# EAGLE design W061C (EAGLE 6.6.0)
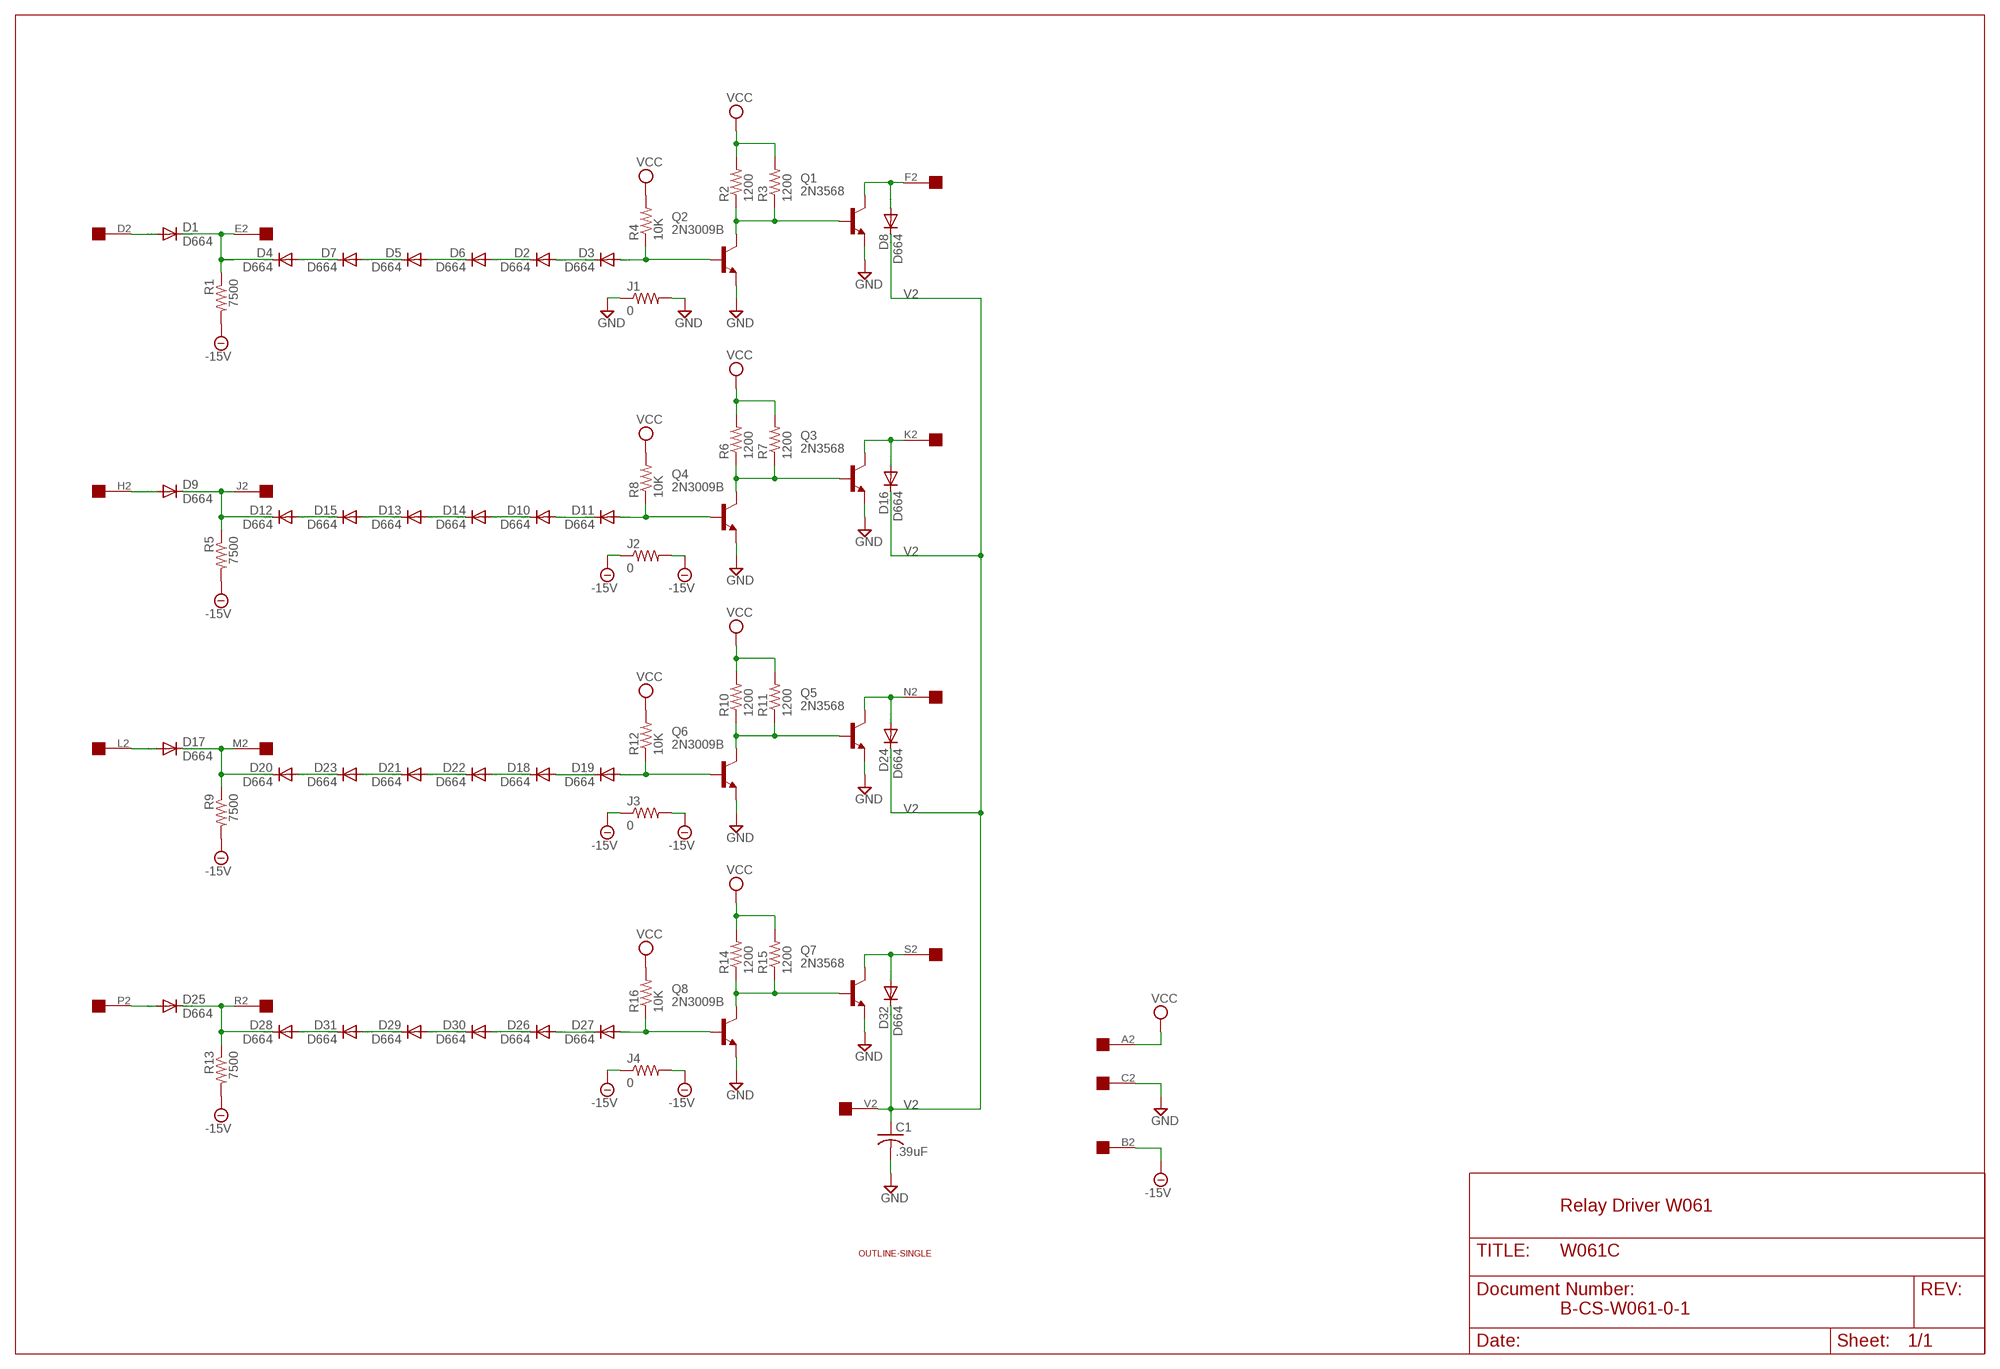
[diagram p0: schematic, sheet 1]

## Parts
C1  .39uF  C-US375-155X418  [C375-155X418]
D1  D664  DIODE-DO35-10  [DO35-10]
D2  D664  DIODE-DO35-10  [DO35-10]
D3  D664  DIODE-DO35-10  [DO35-10]
D4  D664  DIODE-DO35-10  [DO35-10]
D5  D664  DIODE-DO35-10  [DO35-10]
D6  D664  DIODE-DO35-10  [DO35-10]
D7  D664  DIODE-DO35-10  [DO35-10]
D8  D664  DIODE-DO35-10  [DO35-10]
D9  D664  DIODE-DO35-10  [DO35-10]
D10  D664  DIODE-DO35-10  [DO35-10]
D11  D664  DIODE-DO35-10  [DO35-10]
D12  D664  DIODE-DO35-10  [DO35-10]
D13  D664  DIODE-DO35-10  [DO35-10]
D14  D664  DIODE-DO35-10  [DO35-10]
D15  D664  DIODE-DO35-10  [DO35-10]
D16  D664  DIODE-DO35-10  [DO35-10]
D17  D664  DIODE-DO35-10  [DO35-10]
D18  D664  DIODE-DO35-10  [DO35-10]
D19  D664  DIODE-DO35-10  [DO35-10]
D20  D664  DIODE-DO35-10  [DO35-10]
D21  D664  DIODE-DO35-10  [DO35-10]
D22  D664  DIODE-DO35-10  [DO35-10]
D23  D664  DIODE-DO35-10  [DO35-10]
D24  D664  DIODE-DO35-10  [DO35-10]
D25  D664  DIODE-DO35-10  [DO35-10]
D26  D664  DIODE-DO35-10  [DO35-10]
D27  D664  DIODE-DO35-10  [DO35-10]
D28  D664  DIODE-DO35-10  [DO35-10]
D29  D664  DIODE-DO35-10  [DO35-10]
D30  D664  DIODE-DO35-10  [DO35-10]
D31  D664  DIODE-DO35-10  [DO35-10]
D32  D664  DIODE-DO35-10  [DO35-10]
J1  0  R-US_0207/10  [0207/10]
J2  0  R-US_0207/10  [0207/10]
J3  0  R-US_0207/10  [0207/10]
J4  0  R-US_0207/10  [0207/10]
Q1  2N3568  -NPN-TO5  [TO5]
Q2  2N3009B  -NPN-TO5  [TO5]
Q3  2N3568  -NPN-TO5  [TO5]
Q4  2N3009B  -NPN-TO5  [TO5]
Q5  2N3568  -NPN-TO5  [TO5]
Q6  2N3009B  -NPN-TO5  [TO5]
Q7  2N3568  -NPN-TO5  [TO5]
Q8  2N3009B  -NPN-TO5  [TO5]
R1  7500  R-US_0207/10  [0207/10]
R2  1200  R-US_0207/10  [0207/10]
R3  1200  R-US_0207/10  [0207/10]
R4  10K  R-US_0207/10  [0207/10]
R5  7500  R-US_0207/10  [0207/10]
R6  1200  R-US_0207/10  [0207/10]
R7  1200  R-US_0207/10  [0207/10]
R8  10K  R-US_0207/10  [0207/10]
R9  7500  R-US_0207/10  [0207/10]
R10  1200  R-US_0207/10  [0207/10]
R11  1200  R-US_0207/10  [0207/10]
R12  10K  R-US_0207/10  [0207/10]
R13  7500  R-US_0207/10  [0207/10]
R14  1200  R-US_0207/10  [0207/10]
R15  1200  R-US_0207/10  [0207/10]
R16  10K  R-US_0207/10  [0207/10]
U$1  OUTLINE-SINGLE  [SINGLE]
U$2  EDGE-1  [EDGE-CON1]

## Nets
-15V: J2.1 J2.2 J3.1 J3.2 J4.1 J4.2 R1.2 R5.2 R9.2 R13.2 U$2.B2
D2: D1.A U$2.D2
E2: D1.C D4.C R1.1 U$2.E2
F2: D8.A Q1.3(C) U$2.F2
GND: C1.2 J1.1 J1.2 Q1.1(E) Q2.1(E) Q3.1(E) Q4.1(E) Q5.1(E) Q6.1(E) Q7.1(E) Q8.1(E) U$2.C2
H2: D9.A U$2.H2
J2: D9.C D12.C R5.1 U$2.J2
K2: D16.A Q3.3(C) U$2.K2
L2: D17.A U$2.L2
M2: D17.C D20.C R9.1 U$2.M2
N2: D24.A Q5.3(C) U$2.N2
N$1: D13.A D14.C
N$2: D5.A D6.C
N$3: D5.C D7.A
N$4: D2.C D6.A
N$5: D13.C D15.A
N$6: D4.A D7.C
N$7: D3.A Q2.2(B) R4.1
N$8: D2.A D3.C
N$9: D10.C D14.A
N$10: D12.A D15.C
N$11: D11.A Q4.2(B) R8.1
N$12: D10.A D11.C
N$13: Q3.2(B) Q4.3(C) R6.1 R7.1
N$16: Q1.2(B) Q2.3(C) R2.1 R3.1
N$18: D21.A D22.C
N$19: D21.C D23.A
N$20: D18.C D22.A
N$21: D20.A D23.C
N$22: D19.A Q6.2(B) R12.1
N$23: D18.A D19.C
N$24: Q5.2(B) Q6.3(C) R10.1 R11.1
N$28: D29.A D30.C
N$29: D29.C D31.A
N$30: D26.C D30.A
N$31: D28.A D31.C
N$32: D27.A Q8.2(B) R16.1
N$33: D26.A D27.C
N$34: Q7.2(B) Q8.3(C) R14.1 R15.1
P2: D25.A U$2.P2
R2: D25.C D28.C R13.1 U$2.R2
S2: D32.A Q7.3(C) U$2.S2
V2: C1.1 D8.C D16.C D24.C D32.C U$2.V2
VCC: R2.2 R3.2 R4.2 R6.2 R7.2 R8.2 R10.2 R11.2 R12.2 R14.2 R15.2 R16.2 U$2.A2
Unconnected: U$2.T2 U$2.U2

## Notes on the sheet
- Relay Driver W061
- B-CS-W061-0-1

## Library data of the parts
C1 = rcl:C-US: CAPACITOR, American symbol
D1-D32 = diode:DIODE-: DIODE
J1-J4 R1-R16 = rcl:R-US_: RESISTOR, American symbol
Q1-Q8 = transistor:*-NPN-: NPN Transistror BF959 corrected 2008.03.06
U$1 = dec-con:OUTLINE-*: Board outlines for DEC boards.
U$2 = dec-con:EDGE-1: Single-Sided DEC Edge Connector -- (side 2)

## Board
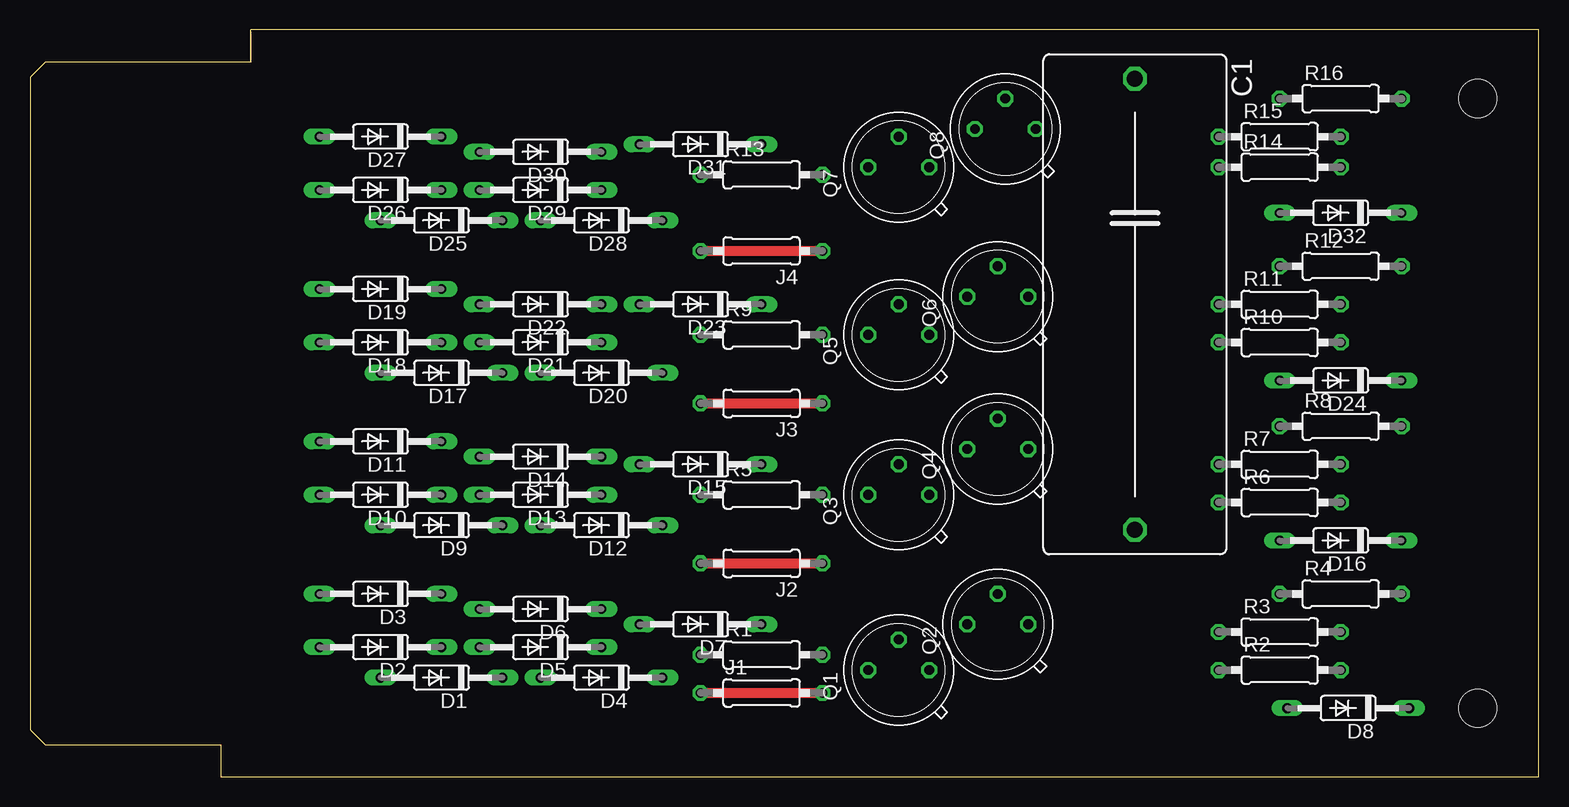
[diagram p1: board, top side]
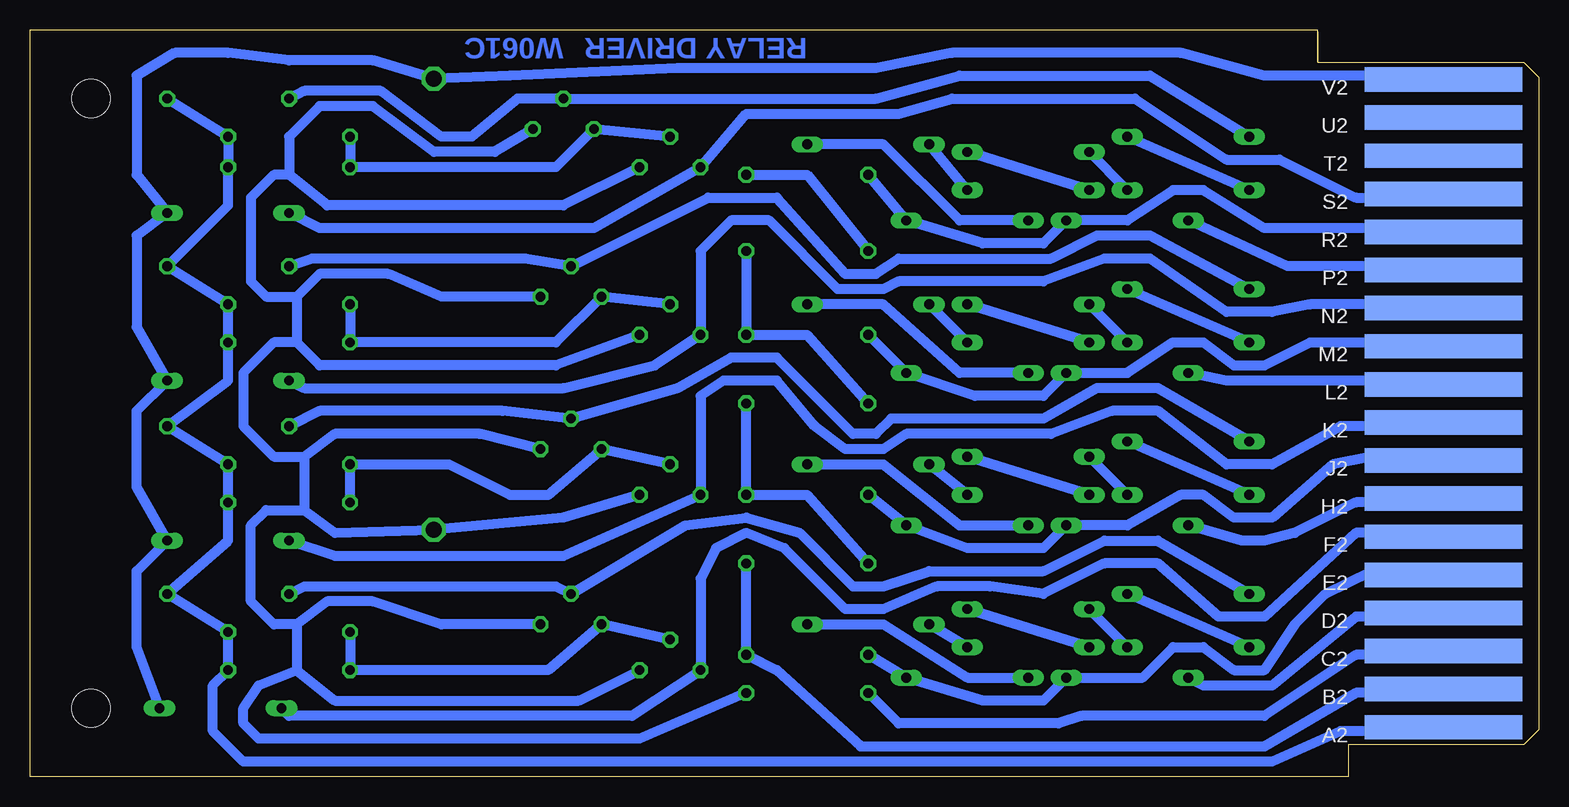
[diagram p2: board, bottom side, seen from below]

Size 125.73 x 62.23 mm. Coordinates in mm from the lower left corner, seen from the top.
Copper layers (1+16): Top 0.035mm / dielectric 1.5mm / Bottom 0.035mm
Design rules "16mils": minimum track width 16mil, minimum drill 32mil, track to track 15mil, track to pad 10mil, pad to pad 10mil, via to via 10mil, smd to smd 10mil, copper to edge 13mil, drill to drill 10mil, minimum pad ring 10mil, minimum via ring 8mil, stop-mask expansion 0mil, vias tented up to drill 0mil, thermal gap 10mil

### Footprints (pad centres in the part's own frame; a part is rotated, then mirrored left to right if it is on the bottom)
C375-155X418 = drill 1.321 octagon: 1 -18.796,0; 2 18.796,0
DO35-10 = drill 0.813 long: A 5.08,0; C -5.08,0
0207/10 = drill 0.813 octagon: 1 -5.08,0; 2 5.08,0
TO5 = drill 0.813 octagon: 1 0,-2.54; 2 2.54,0; 3 0,2.54
SINGLE = hole 3.175: 120.65,56.515; 120.65,5.715
EDGE-CON1 = smd 13.106 x 2.032 bottom: A2 7.938,4.128; B2 7.938,7.303; C2 7.938,10.477; D2 7.938,13.652; E2 7.938,16.828; F2 7.938,20.003; H2 7.938,23.177; J2 7.938,26.352; K2 7.938,29.527; L2 7.938,32.703; M2 7.938,35.877; N2 7.938,39.053; P2 7.938,42.227; R2 7.938,45.403; S2 7.938,48.578; T2 7.938,51.752; U2 7.938,54.928; V2 7.938,58.102

### Placement (x,y rotation side)
C1  92.08,39.37 270 top
D1  34.29,8.26 180 top
D2  29.21,10.79 180 top
D3  29.21,15.24 180 top
D4  47.63,8.26 180 top
D5  42.55,10.79 180 top
D6  42.55,13.97 180 top
D7  55.88,12.7 180 top
D8  109.86,5.71 180 top
D9  34.29,20.95 180 top
D10  29.21,23.5 180 top
D11  29.21,27.94 180 top
D12  47.63,20.95 180 top
D13  42.55,23.5 180 top
D14  42.55,26.67 180 top
D15  55.88,26.04 180 top
D16  109.22,19.68 180 top
D17  34.29,33.66 180 top
D18  29.21,36.2 180 top
D19  29.21,40.64 180 top
D20  47.63,33.66 180 top
D21  42.55,36.2 180 top
D22  42.55,39.37 180 top
D23  55.88,39.37 180 top
D24  109.22,33.02 180 top
D25  34.29,46.35 180 top
D26  29.21,48.9 180 top
D27  29.21,53.34 180 top
D28  47.63,46.35 180 top
D29  42.55,48.9 180 top
D30  42.55,52.07 180 top
D31  55.88,52.7 180 top
D32  109.22,46.99 180 top
J1  60.96,6.99 0 top
J2  60.96,17.78 180 top
J3  60.96,31.11 180 top
J4  60.96,43.81 180 top
Q1  72.39,8.89 90 top
Q2  80.65,12.7 90 top
Q3  72.39,23.5 90 top
Q4  80.65,27.3 90 top
Q5  72.39,36.83 90 top
Q6  80.65,40.01 90 top
Q7  72.39,50.8 90 top
Q8  81.28,53.98 90 top
R1  60.96,10.16 0 top
R2  104.14,8.89 0 top
R3  104.14,12.06 0 top
R4  109.22,15.24 0 top
R5  60.96,23.5 0 top
R6  104.14,22.86 0 top
R7  104.14,26.04 0 top
R8  109.22,29.21 0 top
R9  60.96,36.83 0 top
R10  104.14,36.2 0 top
R11  104.14,39.37 0 top
R12  109.22,42.55 0 top
R13  60.96,50.16 0 top
R14  104.14,50.8 0 top
R15  104.14,53.34 0 top
R16  109.22,56.52 0 top
U$1  0,0 0 top
U$2  0,0 0 top

### Tracks (layer width: path | path; a pad name or v marks a point on that pad's centre or on a via)
-15V
  Top 0.813: J2.2 J2.1 | J3.2 J3.1 | J4.2 J4.1
  Bottom 0.813: U$2.B2 8.89,6.99 15.24,6.99 22.86,2.54 56.52,2.54 63.5,8.89 R1.2 J2.1 | J2.2 60.96,23.5 R5.2 J3.1 | J4.1 R9.2 60.96,36.83 J3.2 | R13.2 60.96,50.16 J4.2
D2
  Bottom 0.813: D1.A 27.94,7.62 22.23,7.62 15.24,13.34 9.53,13.34 U$2.D2
E2
  Bottom 0.813: U$2.E2 8.89,17.14 13.97,17.14 17.78,15.24 20.32,12.7 22.86,8.89 25.4,8.89 27.94,10.79 30.48,10.79 33.02,8.26 D1.C 41.28,6.35 46.36,6.35 D4.C R1.1
F2
  Bottom 0.813: D8.A 104.14,5.08 75.57,5.08 Q1.3 69.85,16.51 68.58,19.05 66.04,20.32 62.87,19.05 57.79,13.97 54.61,13.97 50.17,15.88 45.72,15.88 41.28,15.24 36.2,17.78 31.75,17.78 26.67,13.34 22.86,13.34 15.24,20.32 10.8,20.32 U$2.F2
GND
  Top 0.813: J1.1 J1.2
  Bottom 0.813: U$2.C2 8.89,10.48 8.89,10.16 15.24,10.16 22.86,5.08 38.1,5.08 40.01,4.45 53.34,4.45 J1.1 | J1.2 74.93,3.17 106.68,3.17 107.95,4.45 107.95,5.71 106.68,7.62 103.51,8.89 | 103.51,8.89 100.33,6.35 80.01,6.35 Q1.1 | Q2.1 91.44,12.7 97.16,14.61 100.97,14.61 103.51,12.7 | 103.51,12.7 103.51,8.89 | Q3.1 81.28,21.59 C1.2 100.33,20.32 102.87,22.23 | Q4.1 88.27,28.57 100.33,28.57 102.87,26.67 | 102.87,26.67 102.87,22.23 | Q5.1 81.92,34.29 101.6,34.29 103.51,36.2 | 103.51,36.2 105.41,36.2 107.95,33.66 107.95,29.21 105.41,26.67 102.87,26.67 | Q6.1 91.44,40.01 95.89,41.91 101.6,41.91 103.51,40.01 | 103.51,40.01 103.51,36.2 | 103.51,12.7 105.41,12.7 107.32,14.61 107.32,20.95 106.05,22.23 102.87,22.23 | Q7.1 81.28,47.62 100.97,47.62 104.14,50.16 | 104.14,50.16 105.41,50.16 107.32,48.26 107.32,41.27 106.05,40.01 103.51,40.01 | Q8.1 87,52.07 92.08,52.07 97.16,55.88 101.6,55.88 104.14,53.34 104.14,50.16
H2
  Bottom 0.813: U$2.H2 8.89,22.86 15.24,22.86 20.32,20.32 22.86,19.68 24.77,19.68 D9.A
J2
  Bottom 0.813: R5.1 D12.C 47.63,19.05 41.28,19.05 D9.C 34.29,20.95 29.85,23.5 27.94,23.5 25.4,21.59 22.23,21.59 17.15,26.04 13.97,26.67 8.26,26.67 U$2.J2
K2
  Bottom 0.813: U$2.K2 8.26,29.21 16.51,29.21 22.23,26.04 26.04,26.04 31.75,30.48 35.56,30.48 40.64,28.57 52.71,28.57 54.61,27.3 57.79,27.3 60.33,29.21 63.5,33.02 67.95,33.02 69.85,31.75 Q3.3 81.28,18.41 100.33,18.41 D16.A
L2
  Bottom 0.813: U$2.L2 9.53,33.02 26.04,33.02 D17.A
M2
  Bottom 0.813: R9.1 D20.C 46.99,31.75 41.28,31.75 D17.C 34.29,33.66 30.48,36.2 27.94,36.2 25.4,34.29 22.86,34.29 19.05,36.2 8.89,36.2 U$2.M2
N2
  Bottom 0.813: D24.A 102.87,32.38 81.28,32.38 73.66,34.29 Q5.3 69.85,43.81 67.31,46.35 64.14,46.35 58.42,40.64 54.61,40.64 53.34,41.27 41.28,41.27 36.2,43.18 32.39,43.18 26.04,38.73 22.23,38.73 19.05,39.37 9.53,39.37 U$2.N2
N$1
  Bottom 0.813: D13.A D14.C
N$2
  Bottom 0.813: D5.A D6.C
N$3
  Bottom 0.813: D5.C D7.A
N$4
  Bottom 0.813: D2.C D6.A
N$5
  Bottom 0.813: D13.C D15.A
N$6
  Bottom 0.813: D7.C 54.61,12.7 47.63,8.26 D4.A
N$7
  Bottom 0.813: R4.1 102.87,15.88 81.92,15.88 Q2.2 71.12,20.95 66.04,21.59 61.6,20.32 57.15,15.88 54.61,15.88 50.8,17.14 41.28,17.14 36.2,19.68 31.75,19.68 D3.A
N$8
  Bottom 0.813: D2.A D3.C
N$9
  Bottom 0.813: D10.C D14.A
N$10
  Bottom 0.813: D15.C 54.61,26.04 48.26,20.95 D12.A
N$11
  Bottom 0.813: R8.1 101.6,30.48 86.36,30.48 Q4.2 71.76,32.38 67.31,34.92 63.5,34.92 57.15,28.57 55.25,28.57 53.98,29.84 41.28,29.84 36.83,32.38 31.75,32.38 D11.A
N$12
  Bottom 0.813: D10.A D11.C
N$13
  Bottom 0.813: Q3.2 Q4.3 82.55,23.5 85.73,23.5 90.81,26.04 R7.1 R6.1
N$16
  Bottom 0.813: R3.1 R2.1 82.55,8.89 Q2.3 Q1.2
N$18
  Bottom 0.813: D21.A D22.C
N$19
  Bottom 0.813: D21.C D23.A
N$20
  Bottom 0.813: D18.C D22.A
N$21
  Bottom 0.813: D20.A 48.26,33.66 54.61,39.37 D23.C
N$22
  Bottom 0.813: D19.A 32.39,45.09 36.83,45.09 40.64,43.18 53.34,43.18 55.25,41.91 57.79,41.91 63.5,48.26 69.22,48.26 Q6.2 84.46,43.18 102.24,43.18 R12.1
N$23
  Bottom 0.813: D18.A D19.C
N$24
  Bottom 0.813: Q5.2 Q6.3 81.92,36.2 R10.1 R11.1
N$28
  Bottom 0.813: D29.A D30.C
N$29
  Bottom 0.813: D29.C D31.A
N$30
  Bottom 0.813: D26.C D30.A
N$31
  Bottom 0.813: D28.A 48.26,46.35 54.61,52.7 D31.C
N$32
  Bottom 0.813: D27.A 32.39,58.42 48.26,58.42 55.25,56.52 Q8.2 85.09,56.52 88.9,53.34 91.44,53.34 96.52,57.15 102.87,57.15 R16.1
N$33
  Bottom 0.813: D26.A D27.C
N$34
  Bottom 0.813: Q7.2 Q8.3 81.92,50.8 R14.1 R15.1
P2
  Bottom 0.813: U$2.P2 8.89,42.55 20.96,42.55 D25.A
R2
  Bottom 0.813: R13.1 D28.C 46.36,44.45 41.28,44.45 D25.C 34.29,46.35 30.48,48.9 27.94,48.9 22.86,45.72 8.89,45.72 U$2.R2
S2
  Bottom 0.813: U$2.S2 8.26,48.26 15.24,48.26 21.59,51.44 26.04,51.44 33.66,56.52 48.9,56.52 53.34,55.24 66.04,55.24 Q7.3 78.74,45.72 101.6,45.72 D32.A
V2
  Bottom 0.813: U$2.V2 8.89,58.42 22.86,58.42 29.85,60.33 48.9,60.33 55.25,59.05 71.76,59.05 85.73,58.42 C1.1 97.16,59.69 104.14,59.69 109.22,60.33 113.67,60.33 116.84,58.42 116.84,50.16 D32.C 116.84,45.09 116.84,37.47 D24.C 116.84,30.48 116.84,24.13 D16.C 116.84,17.14 116.84,10.79 D8.C
VCC
  Bottom 0.813: U$2.A2 8.89,3.81 16.51,3.81 22.23,1.27 107.95,1.27 110.49,3.81 110.49,7.62 R2.2 R3.2 R4.2 109.22,19.68 R6.2 R7.2 R8.2 109.22,33.02 R10.2 R11.2 R12.2 109.22,47.62 R14.2 R15.2 R16.2

### Text on the board
Bottom: RELAY DRIVER | W061C
200bmp: C:/Users/Vince/Documents/eagle/projects/DEC/Wxxx/W061/W061Cbackfb.bmp